# Altium project ICwT_module.PrjPCB
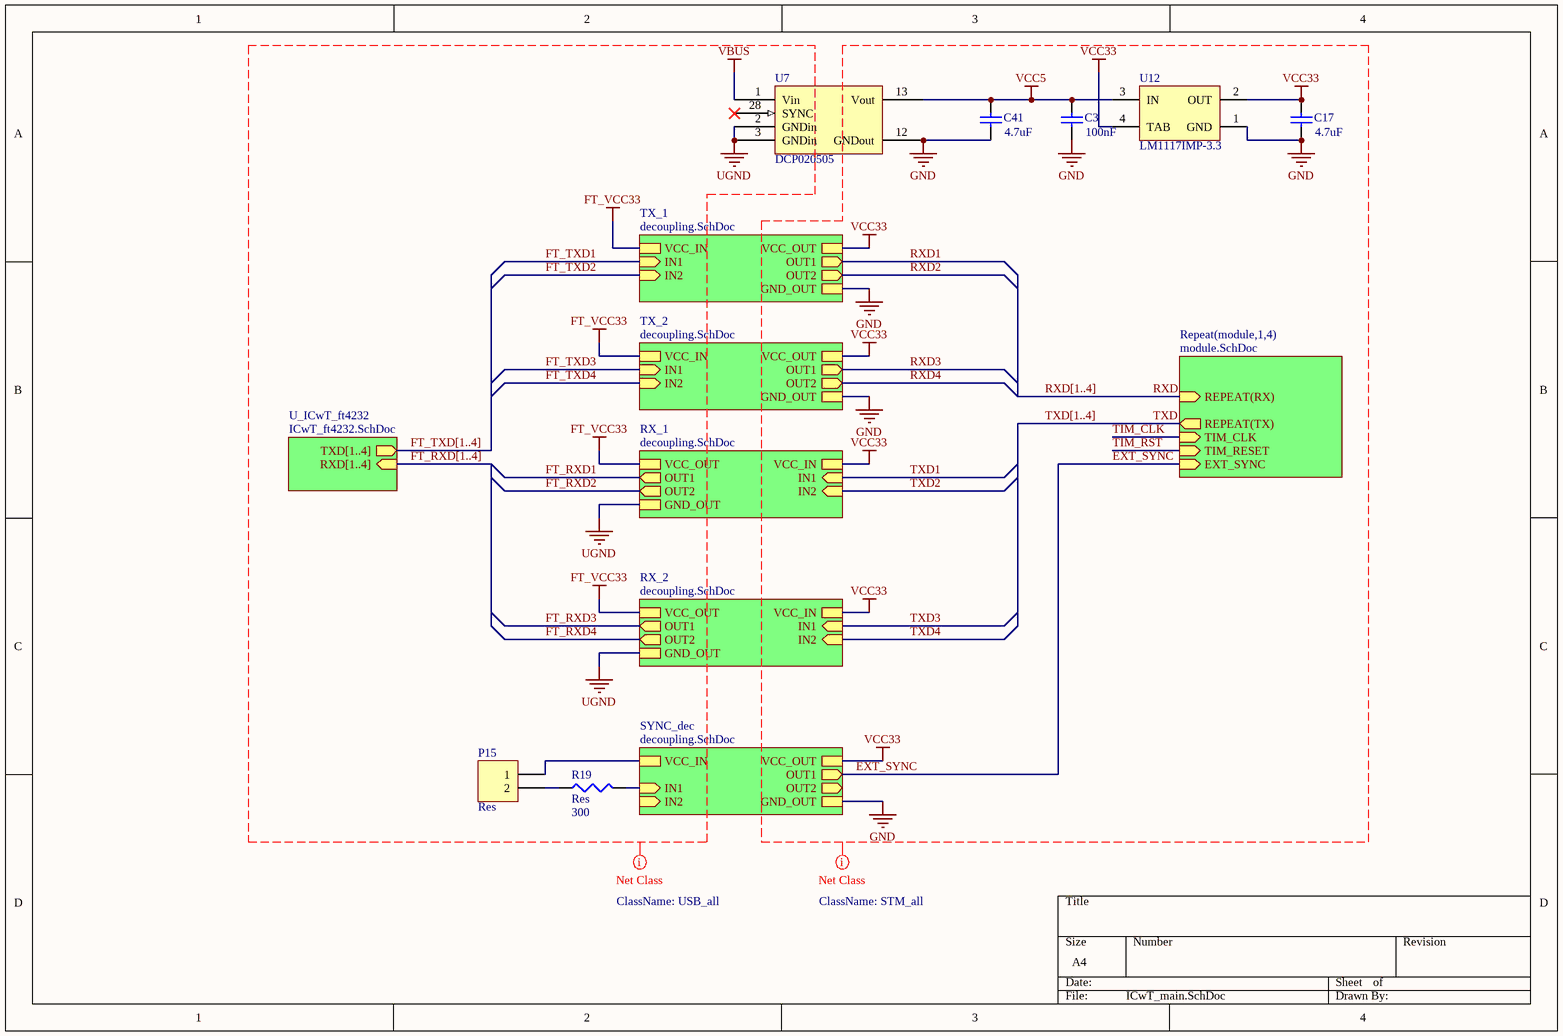
[diagram p0: ICwT_main.SchDoc]
7 sheets, 241 parts. Net scope: hierarchical (ports join the sheet entries above them; power ports are global).
Board files: ICwT.PcbDoc, g738.PcbDoc
Sheets:
  ICwT_main.SchDoc
    TX_2 = decoupling.SchDoc
    SYNC_dec = decoupling.SchDoc
    U_ICwT_ft4232 = ICwT_ft4232.SchDoc
    RX_1 = decoupling.SchDoc
    TX_1 = decoupling.SchDoc
    RX_2 = decoupling.SchDoc
    module1 = module.SchDoc
      STM32 = STM32.SchDoc
      External_iface = RS_iface.SchDoc
      Power selector = Power.SchDoc
    module2 = module.SchDoc
      STM32 = STM32.SchDoc
      External_iface = RS_iface.SchDoc
      Power selector = Power.SchDoc
    module3 = module.SchDoc
      STM32 = STM32.SchDoc
      External_iface = RS_iface.SchDoc
      Power selector = Power.SchDoc
    module4 = module.SchDoc
      STM32 = STM32.SchDoc
      External_iface = RS_iface.SchDoc
      Power selector = Power.SchDoc

## Sheet ICwT_main.SchDoc
size A4

### Parts
(Parts that share a designator on the sheet are numbered #1, #2 ... from top to bottom, then left to right.)
C3#1  value 100nF  [C_0603]  (hidden comment: Cap)
C17#1  value 4.7uF  [C_0603]  (hidden comment: Cap)
C41#1  value 4.7uF  [C_0603]  (hidden comment: Cap)
P15#1  Res  [PAS]
R19#1  Res  value 300  [R_0603]
U7#1  DCP020505  [SOP127P1020X280-28M]
U12#1  LM1117IMP-3.3  [MP04A_L]

### Sub-sheets
Repeat(module,1,4) = module.SchDoc: TIM_CLK (in), TIM_RESET (in), EXT_SYNC (in), REPEAT(RX) (in), REPEAT(TX) (out)
RX_1 = decoupling.SchDoc: VCC_IN, VCC_OUT, GND_OUT, IN1 (in), OUT1 (out), IN2 (in), OUT2 (out)
RX_2 = decoupling.SchDoc: VCC_IN, VCC_OUT, GND_OUT, IN1 (in), OUT1 (out), IN2 (in), OUT2 (out)
SYNC_dec = decoupling.SchDoc: VCC_IN, VCC_OUT, GND_OUT, IN1 (in), OUT1 (out), IN2 (in), OUT2 (out)
TX_1 = decoupling.SchDoc: VCC_IN, VCC_OUT, GND_OUT, IN1 (in), OUT1 (out), IN2 (in), OUT2 (out)
TX_2 = decoupling.SchDoc: VCC_IN, VCC_OUT, GND_OUT, IN1 (in), OUT1 (out), IN2 (in), OUT2 (out)
U_ICwT_ft4232 = ICwT_ft4232.SchDoc: TXD[1..4] (out), RXD[1..4] (in)

### Nets
FT_VCC33: sheet TX_2/VCC_IN, sheet RX_1/VCC_OUT, sheet TX_1/VCC_IN, sheet RX_2/VCC_OUT
GND: C3#1.1 C17#1.1 C41#1.1 U7#1.12(GNDout) U12#1.1(GND) ; sheet TX_2/GND_OUT, sheet SYNC_dec/GND_OUT, sheet TX_1/GND_OUT
UGND: U7#1.2(GNDin) U7#1.3(GNDin) ; sheet RX_1/GND_OUT, sheet RX_2/GND_OUT
VBUS: U7#1.1(Vin)
VCC5: C3#1.2 C41#1.2 U7#1.13(Vout) U12#1.3(IN)
VCC33: C17#1.2 U12#1.2(OUT) U12#1.4(TAB) ; sheet TX_2/VCC_OUT, sheet SYNC_dec/VCC_OUT, sheet RX_1/VCC_IN, sheet TX_1/VCC_OUT, sheet RX_2/VCC_IN  [project net 3.3VDC]
EXT_SYNC: sheet SYNC_dec/OUT1, sheet Repeat(module,1,4)/EXT_SYNC
RXD: sheet Repeat(module,1,4)/REPEAT(RX)
TXD: sheet Repeat(module,1,4)/REPEAT(TX)
NetP15#1_1: P15#1.1 ; sheet SYNC_dec/VCC_IN
NetP15#1_2: P15#1.2 R19#1.1
NetR19#1_2: R19#1.2 ; sheet SYNC_dec/IN1

Not connected (* = marked no-connect by the designer): U7#1 14(NC) 15(NC) 16(NC) 17(NC) 26(NC) 27(NC) 28(SYNC)*

### Buses and harness runs
bus FT_RXD[1..4] = sheet U_ICwT_ft4232/RXD[1..4]
bus FT_TXD[1..4] = sheet U_ICwT_ft4232/TXD[1..4]
bus RXD[1..4]
bus TXD[1..4]

### Layout directives
net class USB_all: FT_RXD1, FT_RXD2, FT_RXD3, FT_RXD4, FT_RXD[1..4], FT_TXD1, FT_TXD2, FT_TXD3, FT_TXD4, FT_TXD[1..4], FT_VCC33, UGND, VBUS
net class STM_all: EXT_SYNC, GND, RXD, RXD1, RXD2, RXD3, RXD4, RXD[1..4], TIM_CLK, TIM_RST, TXD, TXD1, TXD2, TXD3, TXD4, TXD[1..4], VCC5, VCC33

### Library data of the parts
C3#1 C17#1 C41#1 = Cap: Capacitor; Published: 8-Jun-2000; LatestRevisionDate: 17-Jul-2002; LatestRevisionNote: Re-released for DXP Platform.; PackageReference: RAD-0.3; Publisher: Altium Limited; PackageDescription: Radial Cap, Thru-Hole; 2 Leads; 0.3 in Pin Spacing
P15#1 = Header 2: Header, 2-Pin, 3.5mm pitch; LatestRevisionDate: 17-Jul-2002; LatestRevisionNote: Re-released for DXP Platform.; Publisher: Altium Limited
R19#1 = Res3: Resistor; Published: 8-Jun-2000; LatestRevisionDate: 29-May-2009; LatestRevisionNote: IPC-7351 Footprint Added.; PackageReference: J1-0603; Publisher: Altium Limited; PackageDescription: Chip Resistor
U7#1 = DCP020505: Power galvanic isolation
U12#1 = LM1117IMP-3.3: 800mA Low-Dropout Linear Regulator; Manufacturer: National Semiconductor; CompType: LDO IC; PackageTopMarking: XYTT*N05B; PowerWise: N; Published: 4-Dec-2008; DatasheetVersion: Apr-2006; PackageVersion: revB, Apr-2003; PackageReference: MP04A; Publisher: Altium Limited; PackageDescription: Molded SOT-223, 6.50 x 3.56 x 1.6mm Body, 4 Lead, 2.3mm Pitch; PartNumber: LM1117IMP-3.3; RoHS: O; PinCount: 4; DigiKeyPartNumber: LM1117IMP-3.3CT-ND; Code_JEDEC: TO-261-AA; Code_IPC: SOT223-4; ComponentLink1Description: LM1117 Datasheet; ComponentLink1URL: http://www.national.com/ds/LM/LM1117.pdf; ComponentLink2Description: LM1117 Web Page; ComponentLink2URL: http://www.national.com/pf/LM/LM1117.html; ComponentLink3Description: MP04A Package Page; ComponentLink3URL: http://www.national.com/packaging/folders/mp04a.html

## Sheet decoupling.SchDoc
size A4; DocumentNumber: 2; SheetNumber: 2; SheetTotal: 6
Used 5 times, as channels TX_2, SYNC_dec, RX_1, TX_1, RX_2. Parts and nets are listed once, with the designators drawn on the sheet.
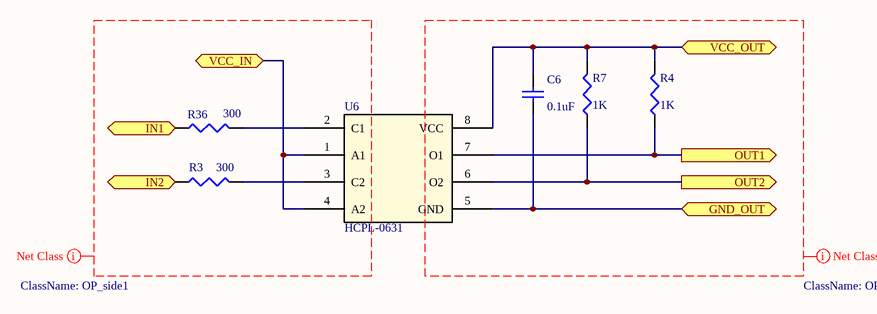
[diagram p1: decoupling.SchDoc]

### Parts
C6  value 0.1uF  [C_0603]  (hidden comment: Cap)
R3  value 300  [R_0603]  (hidden comment: Res)
R4  value 1K  [R_0603]  (hidden comment: Res)
R7  value 1K  [R_0603]  (hidden comment: Res)
R36  value 300  [R_0603]  (hidden comment: Res)
U6  HCPL-0631  [SO8_M]

### Ports
GND_OUT, IN1 (in), IN2 (in), OUT1 (out), OUT2 (out), VCC_IN, VCC_OUT

### Nets
GND_OUT: C6.1 U6.5(GND) ; port GND_OUT
IN1: R36.1 ; port IN1
IN2: R3.1 ; port IN2
OUT1: R4.1 U6.7(O1) ; port OUT1
OUT2: R7.1 U6.6(O2) ; port OUT2
VCC_IN: U6.1(A1) U6.4(A2) ; port VCC_IN
VCC_OUT: C6.2 R4.2 R7.2 U6.8(VCC) ; port VCC_OUT
NetR3_2: R3.2 U6.3(C2)
NetR36_2: R36.2 U6.2(C1)

### Channels
TX_2: designators C6=C54 R3=R44 R4=R36 R7=R40#1 R36=R37 U6=U11; ports GND_OUT=GND IN1=FT_TXD3 IN2=FT_TXD4 OUT1=RX_U OUT2=RX_U VCC_IN=FT_VCC33 VCC_OUT=3.3VDC
SYNC_dec: designators C6=C53 R3=R61 R4=R47 R7=R48 R36=R60 U6=U17; ports GND_OUT=GND IN1=NetR19#1_2 IN2=NetR61_1 OUT1=EXT_SYNC OUT2=NetR48_1 VCC_IN=NetP15#1_1 VCC_OUT=3.3VDC
RX_1: designators C6=C56 R3=R51 R4=R41 R7=R49 R36=R45 U6=U13; ports GND_OUT=UGND IN1=TX_U IN2=TX_U OUT1=FT_RXD1 OUT2=FT_RXD2 VCC_IN=3.3VDC VCC_OUT=FT_VCC33
TX_1: designators C6=C62 R3=R53 R4=R59 R7=R54 R36=R58 U6=U19; ports GND_OUT=GND IN1=FT_TXD1 IN2=FT_TXD2 OUT1=RX_U OUT2=RX_U VCC_IN=FT_VCC33 VCC_OUT=3.3VDC
RX_2: designators C6=C50 R3=R39 R4=R50 R7=R42 R36=R46 U6=U12#2; ports GND_OUT=UGND IN1=TX_U IN2=TX_U OUT1=FT_RXD3 OUT2=FT_RXD4 VCC_IN=3.3VDC VCC_OUT=FT_VCC33

### Layout directives
net class OP_side1: (no net found under the mark)
net class OP_side2: (no net found under the mark)

### Library data of the parts
C6 = Cap Semi: Capacitor; Published: 8-Jun-2000; LatestRevisionDate: 29-May-2009; LatestRevisionNote: IPC-7351 Footprint Added.; PackageReference: C1206; Publisher: Altium Limited; PackageDescription: Chip Capacitor
R3 R4 R7 R36 = Res3: Resistor; Published: 8-Jun-2000; LatestRevisionDate: 29-May-2009; LatestRevisionNote: IPC-7351 Footprint Added.; PackageReference: J1-0603; Publisher: Altium Limited; PackageDescription: Chip Resistor
U6 = HCPL-0631: Optocoupler, dual

## Sheet ICwT_ft4232.SchDoc
size A4
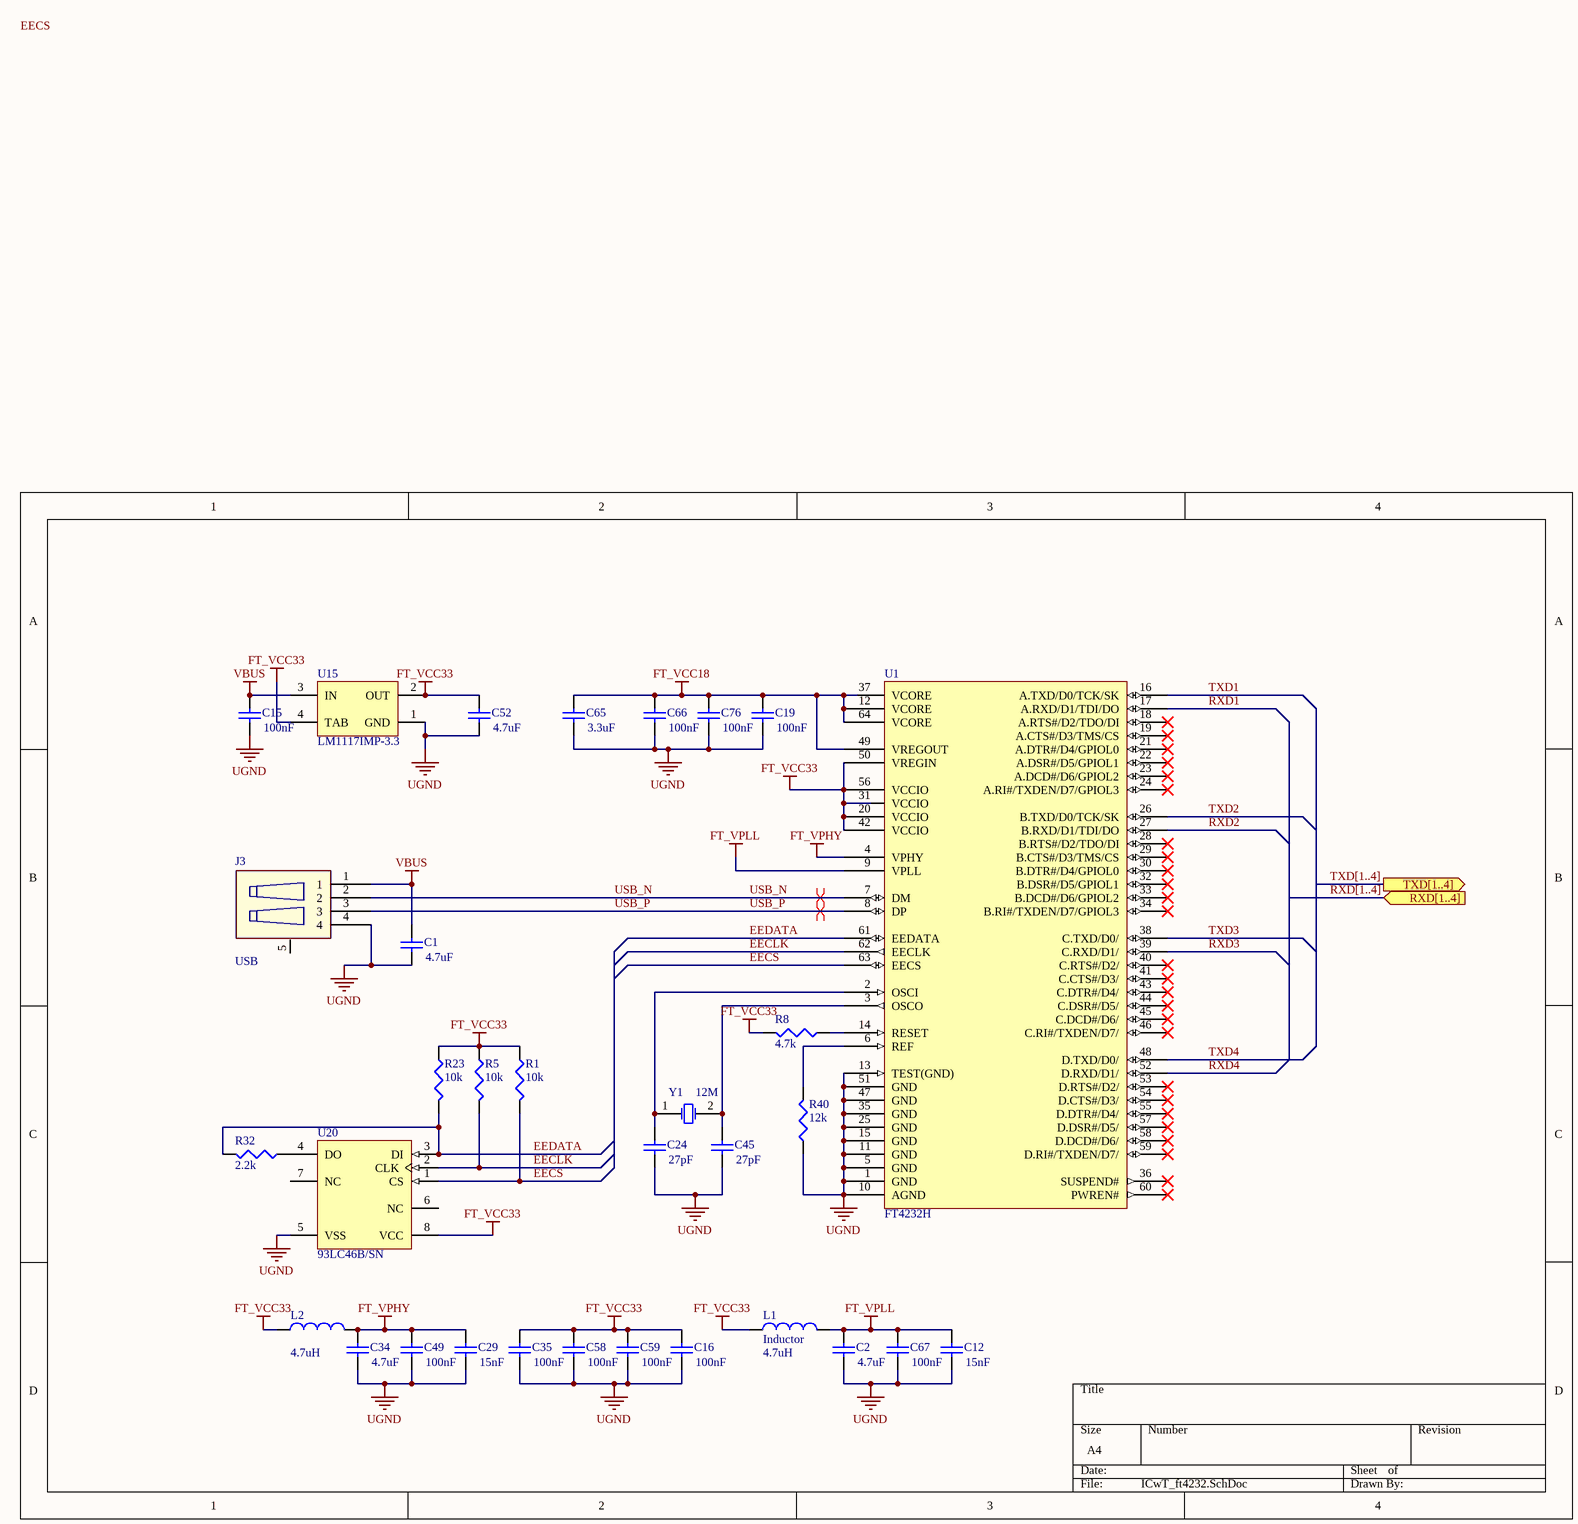
[diagram p2: ICwT_ft4232.SchDoc]

### Parts
(Parts that share a designator on the sheet are numbered #1, #2 ... from top to bottom, then left to right.)
C1#1  value 4.7uF  [C_0603]  (hidden comment: Cap)
C2#1  value 4.7uF  [C_0603]  (hidden comment: Cap)
C12#1  value 15nF  [C_0603]  (hidden comment: Cap)
C15#1  value 100nF  [C_0603]  (hidden comment: Cap)
C16#1  value 100nF  [C_0603]  (hidden comment: Cap)
C19#1  value 100nF  [C_0603]  (hidden comment: Cap)
C24#1  value 27pF  [C_0603]  (hidden comment: Cap)
C29#1  value 15nF  [C_0603]  (hidden comment: Cap)
C34#1  value 4.7uF  [C_0603]  (hidden comment: Cap)
C35#1  value 100nF  [C_0603]  (hidden comment: Cap)
C45#1  value 27pF  [C_0603]  (hidden comment: Cap)
C49#1  value 100nF  [C_0603]  (hidden comment: Cap)
C52#1  value 4.7uF  [C_0603]  (hidden comment: Cap)
C58  value 100nF  [C_0603]  (hidden comment: Cap)
C59  value 100nF  [C_0603]  (hidden comment: Cap)
C65  value 3.3uF  [C_0603]  (hidden comment: Cap)
C66  value 100nF  [C_0603]  (hidden comment: Cap)
C67  value 100nF  [C_0603]  (hidden comment: Cap)
C76  value 100nF  [C_0603]  (hidden comment: Cap)
J3#1  USB  [USBB]
L1  Inductor  value 4.7uH  [L_0805]
L2  value 4.7uH  [L_0805]  (hidden comment: Inductor)
R1#1  value 10k  [R_0603]  (hidden comment: Res)
R5#1  value 10k  [R_0603]  (hidden comment: Res)
R8#1  value 4.7k  [R_0603]  (hidden comment: Res)
R23#1  value 10k  [R_0603]  (hidden comment: Res)
R32#1  value 2.2k  [R_0603]  (hidden comment: Res)
R40#2  value 12k  [R_0603]  (hidden comment: Res)
U1#1  FT4232H  [LQFP64_M]
U15#1  LM1117IMP-3.3  [MP04A_L]
U20  93LC46B/SN  [SOIC-SN8_N]
Y1#1  value 12M  [QUARTZ_0532_MJ]  (hidden comment: SMD XTAL)

### Ports
RXD[1..4] (in), TXD[1..4] (out)

### Nets
FT_VCC18: C19#1.2 C65.2 C66.2 C76.2 U1#1.12(VCORE) U1#1.37(VCORE) U1#1.49(VREGOUT) U1#1.64(VCORE)
FT_VCC33: C16#1.2 C35#1.2 C52#1.2 C58.2 C59.2 L1.1 L2.1 R1#1.1 R5#1.1 R8#1.2 R23#1.1 U1#1.20(VCCIO) U1#1.31(VCCIO) U1#1.42(VCCIO) U1#1.50(VREGIN) U1#1.56(VCCIO) U15#1.2(OUT) U15#1.4(TAB) U20.8(VCC)
FT_VPHY: C29#1.2 C34#1.2 C49#1.2 L2.2 U1#1.4(VPHY)
FT_VPLL: C2#1.2 C12#1.2 C67.2 L1.2 U1#1.9(VPLL)
UGND: C1#1.1 C2#1.1 C12#1.1 C15#1.1 C16#1.1 C19#1.1 C24#1.2 C29#1.1 C34#1.1 C35#1.1 C45#1.2 C49#1.1 C52#1.1 C58.1 C59.1 C65.1 C66.1 C67.1 C76.1 J3#1.4 R40#2.1 U1#1.1(GND) U1#1.5(GND) U1#1.10(AGND) U1#1.11(GND) U1#1.13(TEST(GND)) U1#1.15(GND) U1#1.25(GND) U1#1.35(GND) U1#1.47(GND) U1#1.51(GND) U15#1.1(GND) U20.5(VSS)
VBUS: C1#1.2 C15#1.2 J3#1.1 U15#1.3(IN)
EECLK: R5#1.2 U1#1.62(EECLK) U20.2(CLK)
EECS: R1#1.2 U1#1.63(EECS) U20.1(CS)
EEDATA: R23#1.2 R32#1.2 U1#1.61(EEDATA) U20.3(DI)
RXD1: U1#1.17(A.RXD/D1/TDI/DO)  [project net FT_RXD1]
RXD2: U1#1.27(B.RXD/D1/TDI/DO)  [project net FT_RXD2]
RXD3: U1#1.39(C.RXD/D1/)  [project net FT_RXD3]
RXD4: U1#1.52(D.RXD/D1/)  [project net FT_RXD4]
TXD1: U1#1.16(A.TXD/D0/TCK/SK)  [project net FT_TXD1]
TXD2: U1#1.26(B.TXD/D0/TCK/SK)  [project net FT_TXD2]
TXD3: U1#1.38(C.TXD/D0/)  [project net FT_TXD3]
TXD4: U1#1.48(D.TXD/D0/)  [project net FT_TXD4]
USB_N: J3#1.2 U1#1.7(DM)
USB_P: J3#1.3 U1#1.8(DP)
NetC24#1_1: C24#1.1 U1#1.2(OSCI) Y1#1.1(OSC1)
NetC45#1_1: C45#1.1 U1#1.3(OSCO) Y1#1.2(OSC2)
NetR8#1_1: R8#1.1 U1#1.14(RESET)
NetR32#1_1: R32#1.1 U20.4(DO)
NetR40#2_2: R40#2.2 U1#1.6(REF)

Not connected (* = marked no-connect by the designer): J3#1 5; U1#1 18(A.RTS#/D2/TDO/DI)* 19(A.CTS#/D3/TMS/CS)* 21(A.DTR#/D4/GPIOL0)* 22(A.DSR#/D5/GPIOL1)* 23(A.DCD#/D6/GPIOL2)* 24(A.RI#/TXDEN/D7/GPIOL3)* 28(B.RTS#/D2/TDO/DI)* 29(B.CTS#/D3/TMS/CS)* 30(B.DTR#/D4/GPIOL0)* 32(B.DSR#/D5/GPIOL1)* 33(B.DCD#/D6/GPIOL2)* 34(B.RI#/TXDEN/D7/GPIOL3)* 36(SUSPEND#)* 40(C.RTS#/D2/)* 41(C.CTS#/D3/)* 43(C.DTR#/D4/)* 44(C.DSR#/D5/)* 45(C.DCD#/D6/)* 46(C.RI#/TXDEN/D7/)* 53(D.RTS#/D2/)* 54(D.CTS#/D3/)* 55(D.DTR#/D4/)* 57(D.DSR#/D5/)* 58(D.DCD#/D6/)* 59(D.RI#/TXDEN/D7/)* 60(PWREN#)*; U20 6(NC) 7(NC)

### Buses and harness runs
bus RXD[1..4] = port RXD[1..4]
bus TXD[1..4] = port TXD[1..4]

### Layout directives
differential pair: USB_N, USB_P

### Notes on the sheet
- Labels drawn without touching a wire or pin: EECS

### Library data of the parts
C1#1 C2#1 C12#1 C15#1 C16#1 C19#1 C24#1 C29#1 C34#1 C35#1 C45#1 C49#1 C52#1 C58 C59 C65-C67 C76 = Cap: Capacitor; Published: 8-Jun-2000; LatestRevisionDate: 17-Jul-2002; LatestRevisionNote: Re-released for DXP Platform.; PackageReference: RAD-0.3; Publisher: Altium Limited; PackageDescription: Radial Cap, Thru-Hole; 2 Leads; 0.3 in Pin Spacing
J3#1 = USB: USB-B connector
L1 L2 = Inductor: Code_IEC: 1005; Published: 8-Jun-2000; LatestRevisionDate: 29-May-2009; LatestRevisionNote: IPC-7351 Footprint Added.; PackageReference: 0402-A; Publisher: Altium Limited; PackageDescription: Chip Inductor; Code_JEITA: 0402
R1#1 R5#1 R8#1 R23#1 R32#1 R40#2 = Res3: Resistor; Published: 8-Jun-2000; LatestRevisionDate: 29-May-2009; LatestRevisionNote: IPC-7351 Footprint Added.; PackageReference: J1-0603; Publisher: Altium Limited; PackageDescription: Chip Resistor
U1#1 = FT4232H: USR to RS232 transceiver
U15#1 = LM1117IMP-3.3: as U12#1 on sheet ICwT_main; Published: 4-Dec-2008; DatasheetVersion: Apr-2006; PackageVersion: revB, Apr-2003; PackageReference: MP04A; Publisher: Altium Limited; PackageDescription: Molded SOT-223, 6.50 x 3.56 x 1.6mm Body, 4 Lead, 2.3mm Pitch; PartNumber: LM1117IMP-3.3; RoHS: O; PinCount: 4; DigiKeyPartNumber: LM1117IMP-3.3CT-ND; Code_JEDEC: TO-261-AA; Code_IPC: SOT223-4; ComponentLink1Description: LM1117 Datasheet; ComponentLink1URL: http://www.national.com/ds/LM/LM1117.pdf; ComponentLink2Description: LM1117 Web Page; ComponentLink2URL: http://www.national.com/pf/LM/LM1117.html; ComponentLink3Description: MP04A Package Page; ComponentLink3URL: http://www.national.com/packaging/folders/mp04a.html
U20 = 93LC46B/SN: 1K, 64x16-bit, 2.5V Microwire Serial EEPROM, 8-Pin SOIC 150mil, Commercial Temperature; FirstPublished: 29-Jan-2009; DatasheetVersion: revG, May-2008; PackageVersion: revBB, Aug-2009; PackageReference: SOIC-SN8; Publisher: Altium Limited; PackageDescription: 8-Lead Plastic Small Outline (SN) - Narrow, 3.90mm Body [SOIC]; Supplier 1: Digi-Key; Supplier Part Number 1: 93LC46B/SN-ND; Supplier 2: Farnell; Supplier Part Number 2: 9758224; Supplier 3: Newark; Supplier Part Number 3: 65K1153; Code_JEDEC: MS-012; Code_IPC: SOIC127P600-8; ComponentLink1Description: Datasheet; ComponentLink1URL: http://ww1.microchip.com/downloads/en/DeviceDoc/21749G.pdf; ComponentLink2Description: Packaging Specification; ComponentLink2URL: http://www.microchip.com/stellent/groups/techpub_sg/documents/packagingspec/en012702.pdf; ComponentLink3Description: Microchip.com Home; ComponentLink3URL: http://www.microchip.com/
Y1#1 = XTAL: 0532 12MHz XTAL; pin to pad: 1>2 2>4; Published: 8-Jun-2000; LatestRevisionDate: 17-Jul-2002; LatestRevisionNote: Re-released for DXP Platform.; PackageReference: R38; Publisher: Altium Limited; PackageDescription: Crystal, Thru-Hole; 2 Leads; Body 3.1 x 8.2 mm (Dia.xH)

## Sheet module.SchDoc
size A4
Used 4 times, as channels module1, module2, module3, module4. Parts and nets are listed once, with the designators drawn on the sheet.
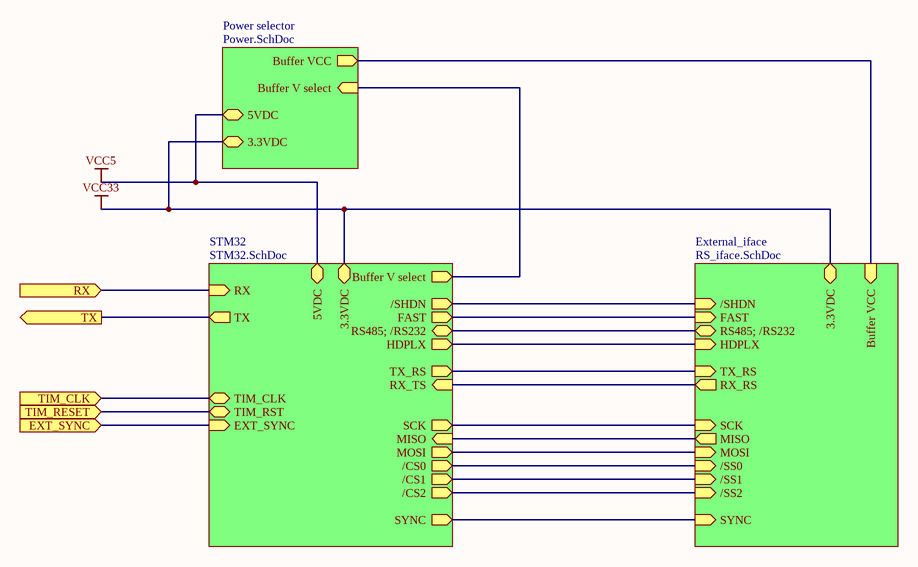
[diagram p3: module.SchDoc]

### Sub-sheets
External_iface = RS_iface.SchDoc: TX_RS (in), RX_RS (out), /SHDN (in), FAST (in), RS485; /RS232, HDPLX (in), SCK (in), MOSI (in), /SS1 (in), /SS2 (in), Buffer VCC (in), SYNC (in), /SS0 (in), MISO (out), 3.3VDC
Power selector = Power.SchDoc: Buffer VCC (out), Buffer V select (in), 5VDC, 3.3VDC
STM32 = STM32.SchDoc: TX_RS (out), RX_TS (in), /SHDN (out), FAST (out), HDPLX (out), Buffer V select (out), 3.3VDC, RS485; /RS232, SCK (out), MISO (in), MOSI (out), /CS2 (out), /CS1 (out), /CS0 (out), SYNC (out), TIM_CLK, EXT_SYNC (in), TIM_RST, 5VDC, TX (out), RX (in)

### Ports
EXT_SYNC (in), RX (in), TIM_CLK (in), TIM_RESET (in), TX (out)

### Nets
VCC5: sheet STM32/5VDC, sheet Power selector/5VDC
VCC33: sheet STM32/3.3VDC, sheet External_iface/3.3VDC, sheet Power selector/3.3VDC
EXT_SYNC: port EXT_SYNC, sheet STM32/EXT_SYNC
RX: port RX, sheet STM32/RX
TIM_CLK: port TIM_CLK, sheet STM32/TIM_CLK
TIM_RESET: port TIM_RESET, sheet STM32/TIM_RST
TX: port TX, sheet STM32/TX
(unnamed): sheet STM32/TX_RS, sheet External_iface/TX_RS
(unnamed): sheet STM32/RX_TS, sheet External_iface/RX_RS
(unnamed): sheet STM32//SHDN, sheet External_iface//SHDN
(unnamed): sheet STM32/FAST, sheet External_iface/FAST
(unnamed): sheet STM32/HDPLX, sheet External_iface/HDPLX
(unnamed): sheet STM32/Buffer V select, sheet Power selector/Buffer V select
(unnamed): sheet STM32/RS485; /RS232, sheet External_iface/RS485; /RS232
(unnamed): sheet STM32/SCK, sheet External_iface/SCK
(unnamed): sheet STM32/MISO, sheet External_iface/MISO
(unnamed): sheet STM32/MOSI, sheet External_iface/MOSI
(unnamed): sheet STM32//CS2, sheet External_iface//SS2
(unnamed): sheet STM32//CS1, sheet External_iface//SS1
(unnamed): sheet STM32//CS0, sheet External_iface//SS0
(unnamed): sheet STM32/SYNC, sheet External_iface/SYNC
(unnamed): sheet External_iface/Buffer VCC, sheet Power selector/Buffer VCC

### Channels
module1: ports EXT_SYNC=EXT_SYNC RX=RX_U TIM_CLK=clk_gen TIM_RESET=rst_gen TX=TX_U
module2: ports EXT_SYNC=EXT_SYNC RX=RX_U TIM_CLK=clk_gen TIM_RESET=rst_gen TX=TX_U
module3: ports EXT_SYNC=EXT_SYNC RX=RX_U TIM_CLK=clk_gen TIM_RESET=rst_gen TX=TX_U
module4: ports EXT_SYNC=EXT_SYNC RX=RX_U TIM_CLK=clk_gen TIM_RESET=rst_gen TX=TX_U

## Sheet STM32.SchDoc
size A3
Used 4 times, as channels module1/STM32, module2/STM32, module3/STM32, module4/STM32. Parts and nets are listed once, with the designators drawn on the sheet.
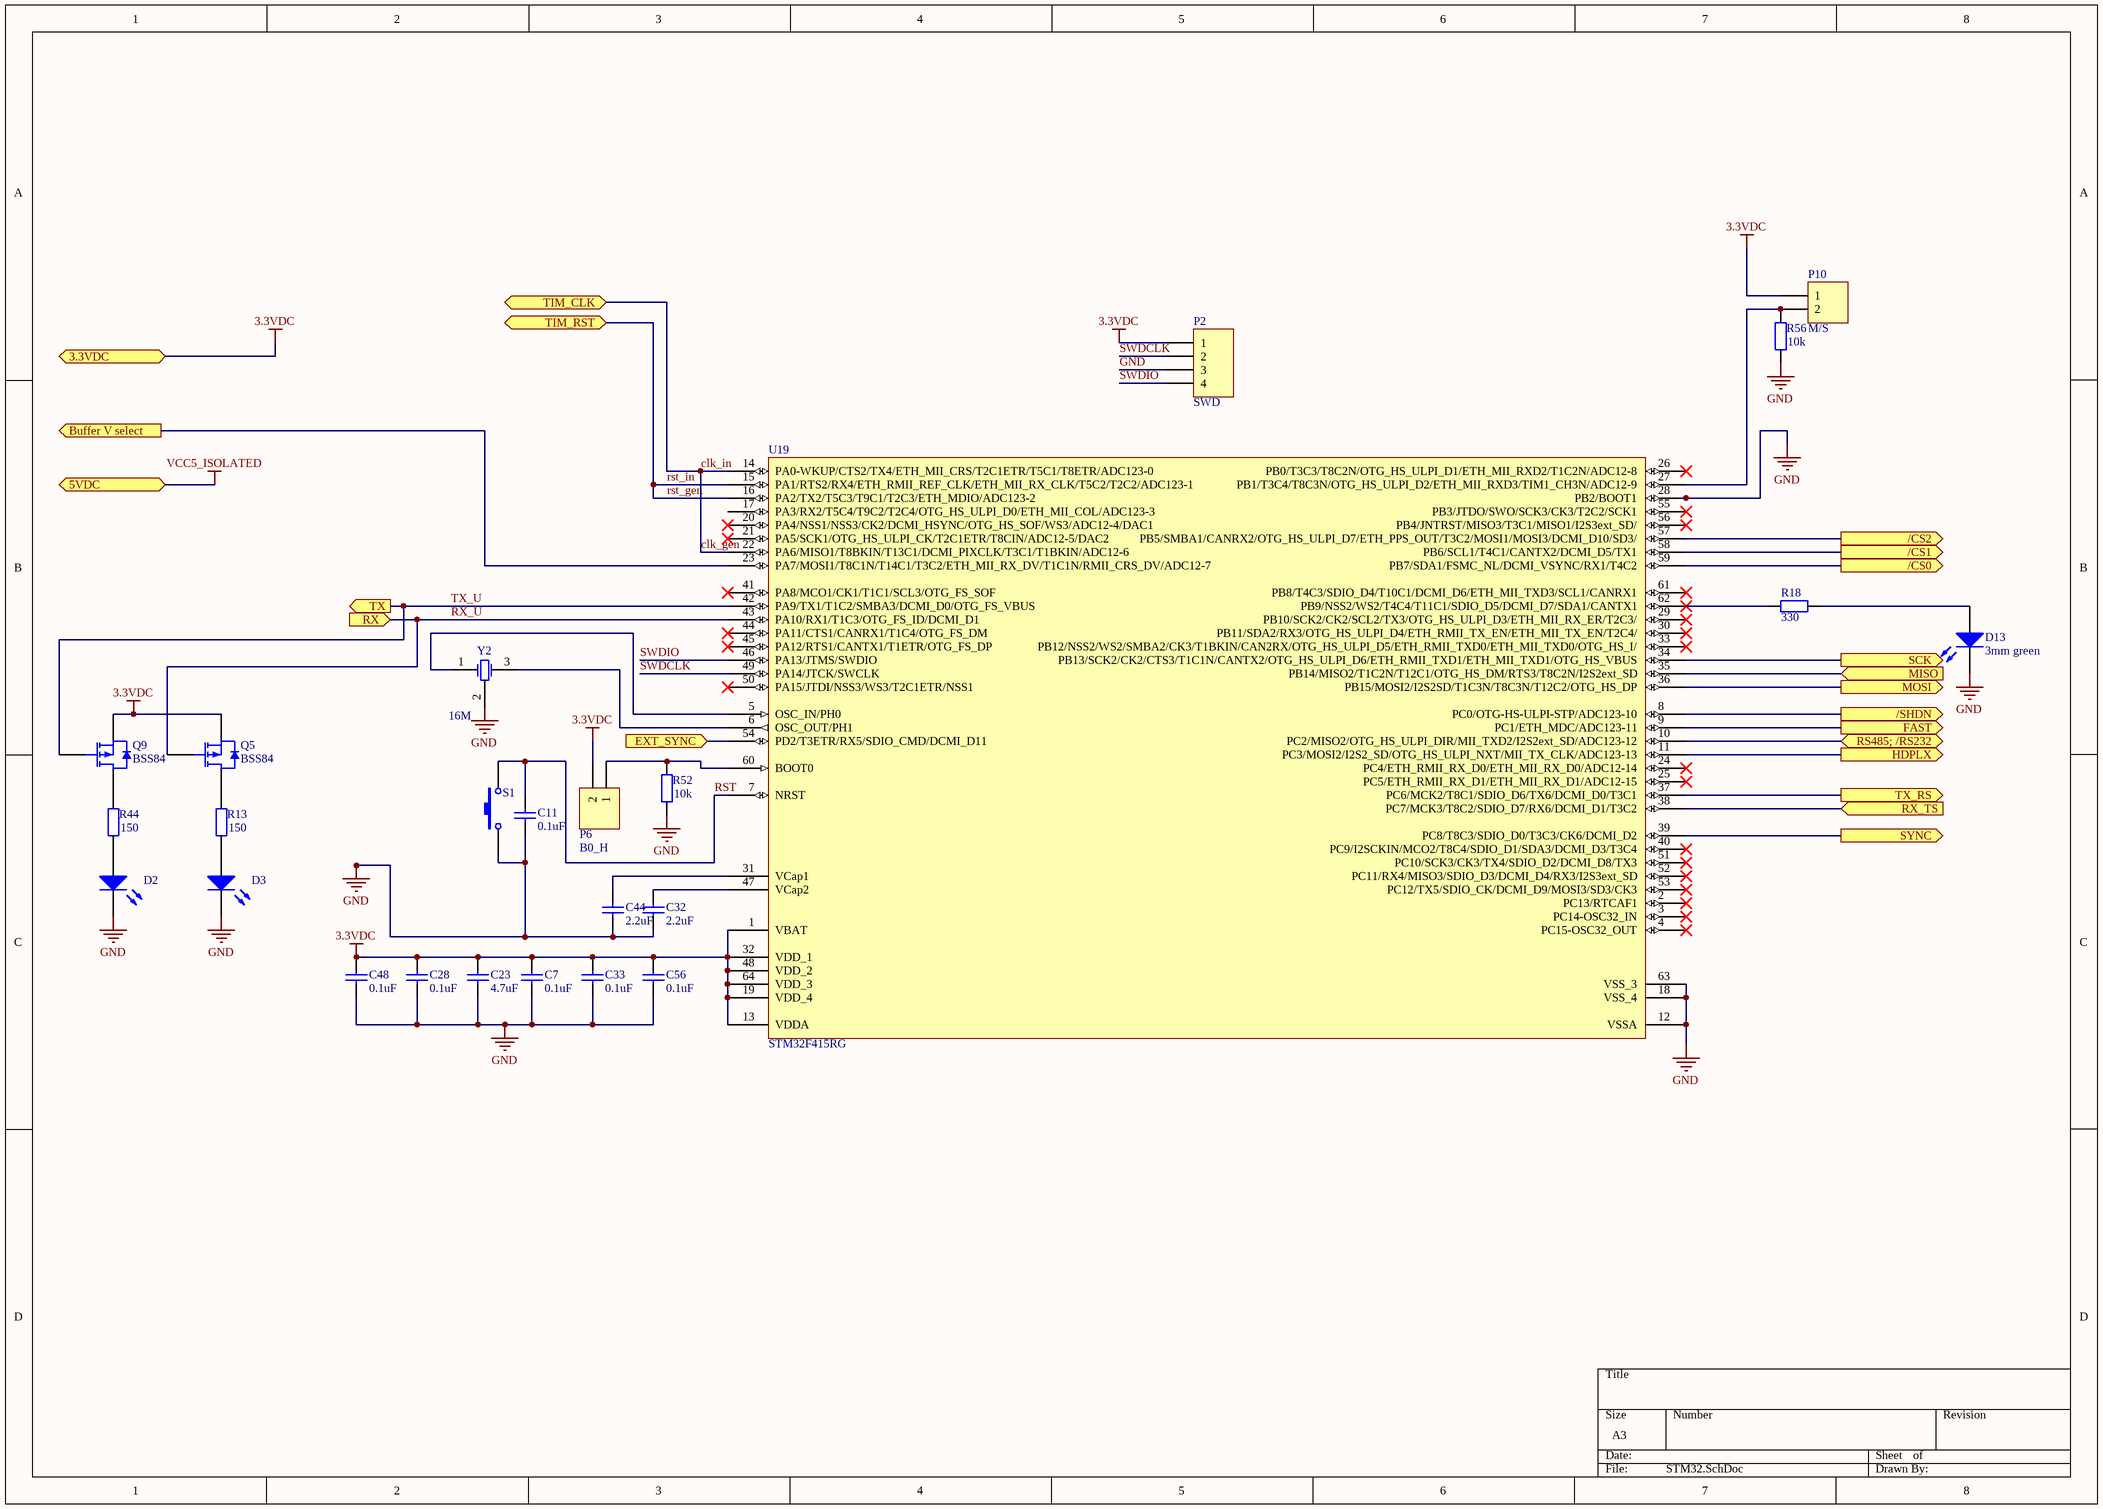
[diagram p4: STM32.SchDoc]

### Parts
C7  value 0.1uF  [C_0603]  (hidden comment: Cap)
C11  value 0.1uF  [C_0603]  (hidden comment: Cap)
C23  value 4.7uF  [C_0603]  (hidden comment: Cap)
C28  value 0.1uF  [C_0603]  (hidden comment: Cap)
C32  value 2.2uF  [C_0603]  (hidden comment: Cap)
C33  value 0.1uF  [C_0603]  (hidden comment: Cap)
C44  value 2.2uF  [C_0603]  (hidden comment: Cap)
C48  value 0.1uF  [C_0603]  (hidden comment: Cap)
C56  value 0.1uF  [C_0603]  (hidden comment: Cap)
D2  3mm led yellow  [Led, 2.54mm pitch]  (value not drawn)
D3  3mm red  [Led, 2.54mm pitch]  (value not drawn)
D13  3mm green  [Led, 2.54mm pitch]
P2  SWD  [HDR1X4]
P6  B0_H  [HDR1X2]
P10  M/S  [HDR1X2]
Q5  BSS84  [SOT23_N]
Q9  BSS84  [SOT23_N]
R13  value 150  [R_0603]  (hidden comment: Res)
R18  value 330  [R_0603]  (hidden comment: Res)
R44  value 150  [R_0603]  (hidden comment: Res)
R52  value 10k  [R_0603]  (hidden comment: Res)
R56  value 10k  [R_0603]  (hidden comment: Res)
S1  RST  [SPST_4DIP]  (value not drawn)
U19  STM32F415RG  [LQFP64]
Y2  value 16M  [XTAL16MHz]  (hidden comment: Murata XTAL)

### Ports
3.3VDC, 5VDC, /CS0 (out), /CS1 (out), /CS2 (out), /SHDN (out), Buffer V select (out), EXT_SYNC (in), FAST (out), HDPLX (out), MISO (in), MOSI (out), RS485; /RS232, RX (in), RX_TS (in), SCK (out), SYNC (out), TIM_CLK, TIM_RST, TX (out), TX_RS (out)

### Nets
3.3VDC: C7.2 C23.2 C28.2 C33.2 C48.2 C56.2 P2.1 P6.2 P10.1 Q5.2(S) Q9.2(S) U19.1(VBAT) U19.13(VDDA) U19.19(VDD_4) U19.32(VDD_1) U19.48(VDD_2) U19.64(VDD_3) ; port 3.3VDC
GND: C7.1 C11.1 C23.1 C28.1 C32.1 C33.1 C44.1 C48.1 C56.1 D2.2(K) D3.2(K) D13.2(K) P2.3 R52.1 R56.1 S1.1 U19.12(VSSA) U19.18(VSS_4) U19.28(PB2/BOOT1) U19.63(VSS_3) Y2.2
VCC5_ISOLATED: port 5VDC
/CS0: U19.59(PB7/SDA1/FSMC_NL/DCMI_VSYNC/RX1/T4C2) ; port /CS0
/CS1: U19.58(PB6/SCL1/T4C1/CANTX2/DCMI_D5/TX1) ; port /CS1
/CS2: U19.57(PB5/SMBA1/CANRX2/OTG_HS_ULPI_D7/ETH_PPS_OUT/T3C2/MOSI1/MOSI3/DCMI_D10/SD3/) ; port /CS2
/SHDN: U19.8(PC0/OTG-HS-ULPI-STP/ADC123-10) ; port /SHDN
Buffer V select: U19.23(PA7/MOSI1/T8C1N/T14C1/T3C2/ETH_MII_RX_DV/T1C1N/RMII_CRS_DV/ADC12-7) ; port Buffer V select
clk_gen: U19.14(PA0-WKUP/CTS2/TX4/ETH_MII_CRS/T2C1ETR/T5C1/T8ETR/ADC123-0) U19.22(PA6/MISO1/T8BKIN/T13C1/DCMI_PIXCLK/T3C1/T1BKIN/ADC12-6) ; port TIM_CLK  [also labelled clk_in]
EXT_SYNC: U19.54(PD2/T3ETR/RX5/SDIO_CMD/DCMI_D11) ; port EXT_SYNC
FAST: U19.9(PC1/ETH_MDC/ADC123-11) ; port FAST
HDPLX: U19.11(PC3/MOSI2/I2S2_SD/OTG_HS_ULPI_NXT/MII_TX_CLK/ADC123-13) ; port HDPLX
MISO: U19.35(PB14/MISO2/T1C2N/T12C1/OTG_HS_DM/RTS3/T8C2N/I2S2ext_SD) ; port MISO
MOSI: U19.36(PB15/MOSI2/I2S2SD/T1C3N/T8C3N/T12C2/OTG_HS_DP) ; port MOSI
RS485; /RS232: U19.10(PC2/MISO2/OTG_HS_ULPI_DIR/MII_TXD2/I2S2ext_SD/ADC123-12) ; port RS485; /RS232
RST: C11.2 S1.2 U19.7(NRST)
rst_gen: U19.15(PA1/RTS2/RX4/ETH_RMII_REF_CLK/ETH_MII_RX_CLK/T5C2/T2C2/ADC123-1) U19.16(PA2/TX2/T5C3/T9C1/T2C3/ETH_MDIO/ADC123-2) ; port TIM_RST  [also labelled rst_in]
RX_TS: U19.38(PC7/MCK3/T8C2/SDIO_D7/RX6/DCMI_D1/T3C2) ; port RX_TS
RX_U: Q5.1(G) U19.43(PA10/RX1/T1C3/OTG_FS_ID/DCMI_D1) ; port RX
SCK: U19.34(PB13/SCK2/CK2/CTS3/T1C1N/CANTX2/OTG_HS_ULPI_D6/ETH_RMII_TXD1/ETH_MII_TXD1/OTG_HS_VBUS) ; port SCK
SWDCLK: P2.2 U19.49(PA14/JTCK/SWCLK)
SWDIO: P2.4 U19.46(PA13/JTMS/SWDIO)
SYNC: U19.39(PC8/T8C3/SDIO_D0/T3C3/CK6/DCMI_D2) ; port SYNC
TX_RS: U19.37(PC6/MCK2/T8C1/SDIO_D6/TX6/DCMI_D0/T3C1) ; port TX_RS
TX_U: Q9.1(G) U19.42(PA9/TX1/T1C2/SMBA3/DCMI_D0/OTG_FS_VBUS) ; port TX
NetC32_2: C32.2 U19.47(VCap2)
NetC44_2: C44.2 U19.31(VCap1)
NetD2_1: D2.1(A) R44.1
NetD3_1: D3.1(A) R13.1
NetD13_1: D13.1(A) R18.2
NetP6_1: P6.1 R52.2 U19.60(BOOT0)
NetP10_2: P10.2 R56.2 U19.27(PB1/T3C4/T8C3N/OTG_HS_ULPI_D2/ETH_MII_RXD3/TIM1_CH3N/ADC12-9)
NetQ5_3: Q5.3(D) R13.2
NetQ9_3: Q9.3(D) R44.2
NetR18_1: R18.1 U19.62(PB9/NSS2/WS2/T4C4/T11C1/SDIO_D5/DCMI_D7/SDA1/CANTX1)
NetU19_5: U19.5(OSC_IN/PH0) Y2.1
NetU19_6: U19.6(OSC_OUT/PH1) Y2.3

Not connected (* = marked no-connect by the designer): U19 2(PC13/RTCAF1)* 3(PC14-OSC32_IN)* 4(PC15-OSC32_OUT)* 17(PA3/RX2/T5C4/T9C2/T2C4/OTG_HS_ULPI_D0/ETH_MII_COL/ADC123-3) 20(PA4/NSS1/NSS3/CK2/DCMI_HSYNC/OTG_HS_SOF/WS3/ADC12-4/DAC1)* 21(PA5/SCK1/OTG_HS_ULPI_CK/T2C1ETR/T8CIN/ADC12-5/DAC2)* 24(PC4/ETH_RMII_RX_D0/ETH_MII_RX_D0/ADC12-14)* 25(PC5/ETH_RMII_RX_D1/ETH_MII_RX_D1/ADC12-15)* 26(PB0/T3C3/T8C2N/OTG_HS_ULPI_D1/ETH_MII_RXD2/T1C2N/ADC12-8)* 29(PB10/SCK2/CK2/SCL2/TX3/OTG_HS_ULPI_D3/ETH_MII_RX_ER/T2C3/)* 30(PB11/SDA2/RX3/OTG_HS_ULPI_D4/ETH_RMII_TX_EN/ETH_MII_TX_EN/T2C4/)* 33(PB12/NSS2/WS2/SMBA2/CK3/T1BKIN/CAN2RX/OTG_HS_ULPI_D5/ETH_RMII_TXD0/ETH_MII_TXD0/OTG_HS_I/)* 40(PC9/I2SCKIN/MCO2/T8C4/SDIO_D1/SDA3/DCMI_D3/T3C4)* 41(PA8/MCO1/CK1/T1C1/SCL3/OTG_FS_SOF)* 44(PA11/CTS1/CANRX1/T1C4/OTG_FS_DM)* 45(PA12/RTS1/CANTX1/T1ETR/OTG_FS_DP)* 50(PA15/JTDI/NSS3/WS3/T2C1ETR/NSS1)* 51(PC10/SCK3/CK3/TX4/SDIO_D2/DCMI_D8/TX3)* 52(PC11/RX4/MISO3/SDIO_D3/DCMI_D4/RX3/I2S3ext_SD)* 53(PC12/TX5/SDIO_CK/DCMI_D9/MOSI3/SD3/CK3)* 55(PB3/JTDO/SWO/SCK3/CK3/T2C2/SCK1)* 56(PB4/JNTRST/MISO3/T3C1/MISO1/I2S3ext_SD/)* 61(PB8/T4C3/SDIO_D4/T10C1/DCMI_D6/ETH_MII_TXD3/SCL1/CANRX1)*

### Channels
module1/STM32: designators C7=C17#2 C11=C25 C23=C38 C28=C46 C32=C33 C33=C21 C44=C13 C48=C30 C56=C41#2 D2=D4 D3=D5 D13=D6 P2=P8 P6=P12 P10=P4 Q5=Q4 Q9=Q8 R13=R28 R18=R20 R44=R32#2 R52=R24 R56=R19#2 S1=S1 U19=U7#2 Y2=Y1#2; ports 3.3VDC=3.3VDC 5VDC=VCC5 /CS0=CS0 /CS1=CS1 /CS2=CS2 /SHDN=/SHDN Buffer V select=NetQ12_2 EXT_SYNC=EXT_SYNC FAST=FAST HDPLX=HDPLX MISO=MISO MOSI=MOSI RS485; /RS232=RS485; /RS232 RX=RX_U RX_TS=RX(TO STM) SCK=SCK SYNC=NetU7#2_39 TIM_CLK=clk_gen TIM_RST=rst_gen TX=TX_U TX_RS=TX(FROM STM)
module2/STM32: designators C7=C18 C11=C26 C23=C39 C28=C47 C32=C34#2 C33=C22 C44=C14 C48=C31 C56=C42 D2=D10 D3=D7 D13=D8 P2=P9 P6=P13 P10=P5 Q5=Q6 Q9=Q10 R13=R29 R18=R21 R44=R33 R52=R25 R56=R16 S1=S3 U19=U8 Y2=Y2; ports 3.3VDC=3.3VDC 5VDC=VCC5 /CS0=CS0 /CS1=CS1 /CS2=CS2 /SHDN=/SHDN Buffer V select=NetQ2_2 EXT_SYNC=EXT_SYNC FAST=FAST HDPLX=HDPLX MISO=MISO MOSI=MOSI RS485; /RS232=RS485; /RS232 RX=RX_U RX_TS=RX(TO STM) SCK=SCK SYNC=NetU2_9 TIM_CLK=clk_gen TIM_RST=rst_gen TX=TX_U TX_RS=TX(FROM STM)
module3/STM32: designators C7=C19#2 C11=C27 C23=C37 C28=C45#2 C32=C35#2 C33=C23 C44=C15#2 C48=C29#2 C56=C43 D2=D11 D3=D9 D13=D12 P2=P10 P6=P14 P10=P6 Q5=Q5 Q9=Q9 R13=R30 R18=R22 R44=R34 R52=R26 R56=R17 S1=S2 U19=U9 Y2=Y3; ports 3.3VDC=3.3VDC 5VDC=VCC5 /CS0=CS0 /CS1=CS1 /CS2=CS2 /SHDN=/SHDN Buffer V select=NetQ1_2 EXT_SYNC=EXT_SYNC FAST=FAST HDPLX=HDPLX MISO=MISO MOSI=MOSI RS485; /RS232=RS485; /RS232 RX=RX_U RX_TS=RX(TO STM) SCK=SCK SYNC=NetU3_9 TIM_CLK=clk_gen TIM_RST=rst_gen TX=TX_U TX_RS=TX(FROM STM)
module4/STM32: designators C7=C20 C11=C28 C23=C40 C28=C48 C32=C36 C33=C24#2 C44=C16#2 C48=C32 C56=C44 D2=D15 D3=D13 D13=D14 P2=P11 P6=P15#2 P10=P7 Q5=Q7 Q9=Q11 R13=R31 R18=R23#2 R44=R35 R52=R27 R56=R18 S1=S4 U19=U10 Y2=Y4; ports 3.3VDC=3.3VDC 5VDC=VCC5 /CS0=CS0 /CS1=CS1 /CS2=CS2 /SHDN=/SHDN Buffer V select=NetQ3_2 EXT_SYNC=EXT_SYNC FAST=FAST HDPLX=HDPLX MISO=MISO MOSI=MOSI RS485; /RS232=RS485; /RS232 RX=RX_U RX_TS=RX(TO STM) SCK=SCK SYNC=NetU1#2_9 TIM_CLK=clk_gen TIM_RST=rst_gen TX=TX_U TX_RS=TX(FROM STM)

### Library data of the parts
C7 C11 C23 C28 C32 C33 C44 C48 C56 = C0603: Capacitor; Note: Footprint corresponds to dimensions for bulk cassette packaging. This case size has tightened tolerances.; Published: 17-Jul-2002; LatestRevisionDate: 19-Mar-2004; LatestRevisionNote: Silkscreen size reduced.; PackageReference: 0603; Publisher: Altium Limited; DatasheetDocument: Mar-2001; PackageDocument: Mar-2001; Code_JEITA: 0603; Code_IPC: 1608 [0603]; ComponentLink1Description: Manufacturer Link; ComponentLink1URL: http://www.kemet.com/; ComponentLink2Description: Datasheet; ComponentLink2URL: http://www.kemet.com/kemet/web/homepage/kechome.nsf/vapubfilesname/F3102TA.pdf/$file/F3102TA.pdf
D2 D3 D13 = LED0: Typical INFRARED GaAs LED; Published: 8-Jun-2000; LatestRevisionDate: 08-Jul-2005; LatestRevisionNote: Mech Layer 1 removed.; PackageReference: LED-0; Publisher: Altium Limited; PackageDescription: LED; 2 Leads
P2 = Header 4H: Header, 4-Pin, 2.54mm pitch; LatestRevisionDate: 17-Jul-2002; LatestRevisionNote: Re-released for DXP Platform.; Publisher: Altium Limited
P6 P10 = Header 2H: Header, 2-Pin, 2.54mm pitch; LatestRevisionDate: 17-Jul-2002; LatestRevisionNote: Re-released for DXP Platform.; Publisher: Altium Limited
Q5 Q9 = BSS84: P-channel Enhancement Mode Vertical D-MOSFET; Published: 17-Sep-2003; LatestRevisionDate: 12-Dec-2006; LatestRevisionNote: IPC-7351 Footprint Added.; DatasheetVersion: 18-Jun-1997; PackageVersion: May-1999; PackageReference: SOT23; Publisher: Altium Limited; PackageDescription: 3-Pin SOT-23 Package 0.95 mm Pitch, 2.3 mm Lead Span; ComponentLink1Description: Manufacturer Link; ComponentLink1URL: http://www.semiconductors.philips.com/; ComponentLink2Description: Datasheet; ComponentLink2URL: http://www.semiconductors.philips.com/acrobat/datasheets/BSS84_3.pdf
R13 R18 R44 R52 R56 = Res2: Resistor; Published: 8-Jun-2000; LatestRevisionDate: 17-Jul-2002; LatestRevisionNote: Re-released for DXP Platform.; PackageReference: AXIAL-0.4; Publisher: Altium Limited; PackageDescription: Axial Device, Thru-Hole; 2 Leads; 0.4 in Pin Spacing
S1 = SW-PB: Reset button; Published: 24-Mar-1999; LatestRevisionDate: 17-Jul-2002; LatestRevisionNote: Re-released for DXP Platform.; PackageReference: SPST-2; Publisher: Altium Limited; PackageDescription: Switch; 2 Leads
U19 = STM32F415RG: ST ARM MC; Published: 30-May-2008; DatasheetVersion: rev6, Mar-2008; PackageVersion: Mar-2008; PackageReference: LQFP64; Publisher: Altium Limited; PackageDescription: 64-Pin Low-Profile Quad Flat Pack, 10 x 10 mm Body, 0.5 mm Pitch (LQFP64); ComponentLink1Description: Manufacturer Link; ComponentLink1URL: www.st.com/stm32; ComponentLink2Description: Datasheet; ComponentLink2URL: http://www.st.com/stonline/products/literature/ds/13586.pdf
Y2 = Murata_XTAL: Murata 16 MHz XTAL

## Sheet RS_iface.SchDoc
size A4
Used 4 times, as channels module1/External_iface, module2/External_iface, module3/External_iface, module4/External_iface. Parts and nets are listed once, with the designators drawn on the sheet.
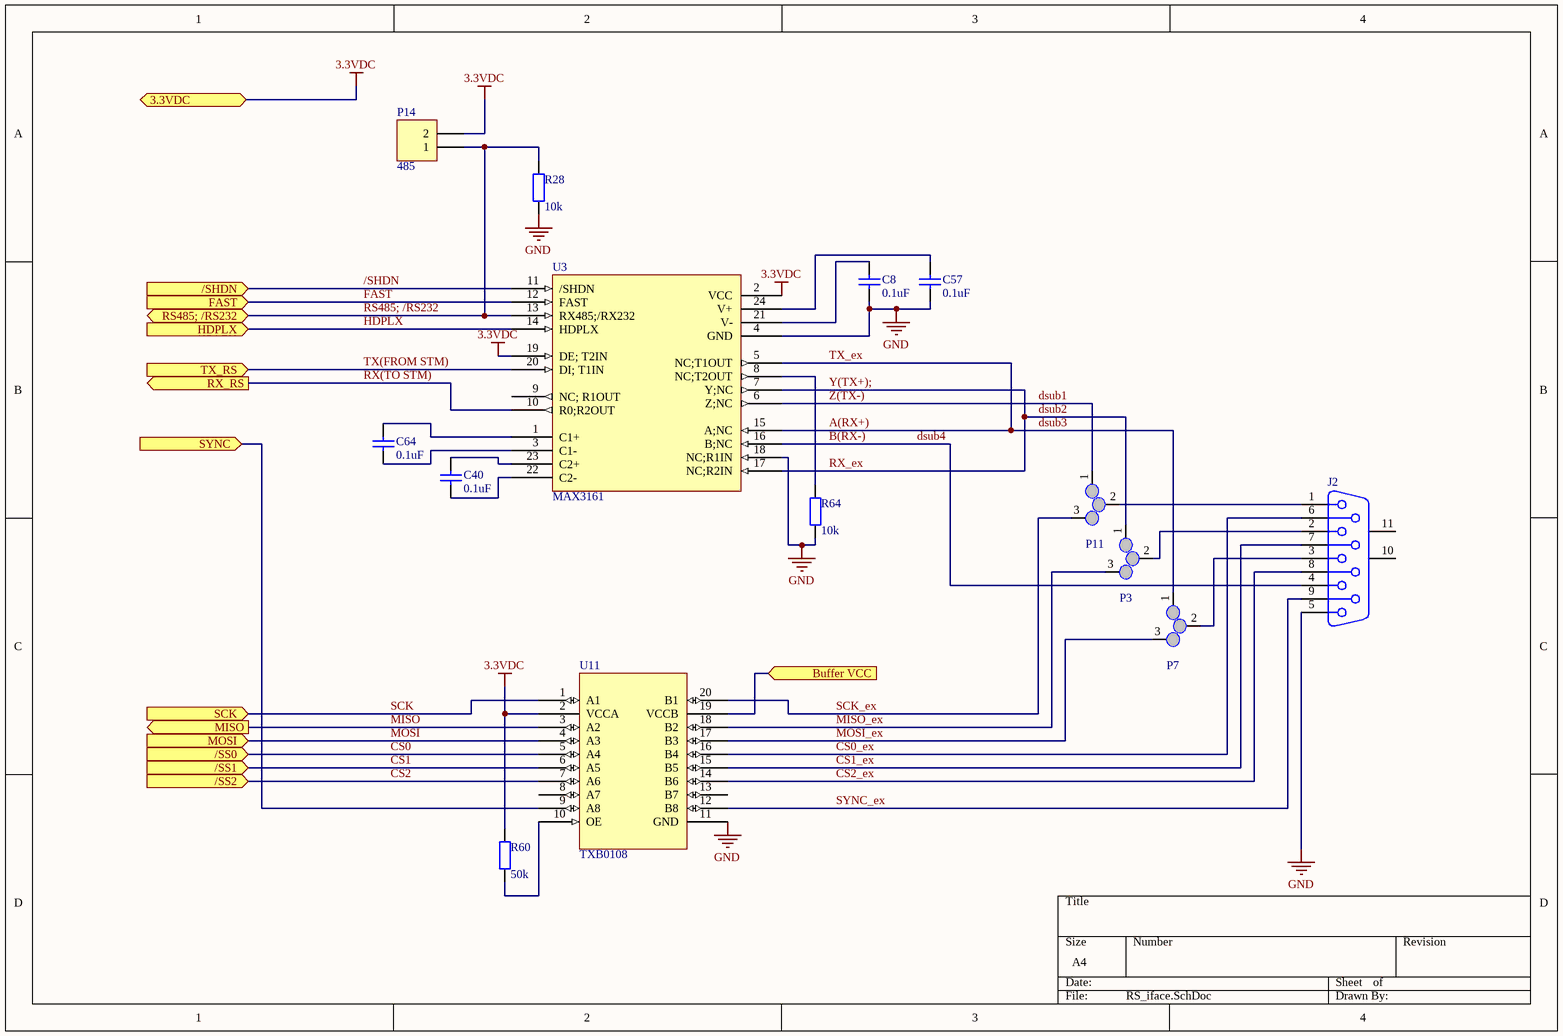
[diagram p5: RS_iface.SchDoc]

### Parts
C8  value 0.1uF  [C_0603]  (hidden comment: Cap)
C40  value 0.1uF  [C_0603]  (hidden comment: Cap)
C57  value 0.1uF  [C_0603]  (hidden comment: Cap)
C64  value 0.1uF  [C_0603]  (hidden comment: Cap)
J2  DSUB Male  [DSUB1.385-2H9M]  (value not drawn)
P3  SWI_CONN  [SW_SPDT]  (value not drawn)  (net tie, no BOM)
P7  SWI_CONN  [SW_SPDT]  (value not drawn)  (net tie, no BOM)
P11  SWI_CONN  [SW_SPDT]  (value not drawn)  (net tie, no BOM)
P14  485  [HDR1X2]
R28  value 10k  [R_0603]  (hidden comment: Res)
R60  value 50k  [R_0603]  (hidden comment: Res)
R64  value 10k  [R_0603]  (hidden comment: Res)
U3  MAX3161  [DB024]
U11  TXB0108  [TSOP65P640X120-20N]

### Ports
3.3VDC, /SHDN (in), /SS0 (in), /SS1 (in), /SS2 (in), Buffer VCC (in), FAST (in), HDPLX (in), MISO (out), MOSI (in), RS485; /RS232, RX_RS (out), SCK (in), SYNC (in), TX_RS (in)

### Nets
3.3VDC: P14.2 R60.2 U3.2(VCC) U3.19(DE;_T2IN) U11.2(VCCA) ; port 3.3VDC
GND: C8.2 C57.2 J2.5 R28.1 R64.1 U3.4(GND) U3.18(NC;R1IN) U11.11(GND)
/SHDN: U3.11(/SHDN) ; port /SHDN
A(RX+): P7.1 U3.5(NC;T1OUT) U3.15(A;NC)  [also labelled dsub3, TX_ex]
B(RX-): J2.4 U3.16(B;NC)  [also labelled dsub4]
Buffer VCC: U11.19(VCCB) ; port Buffer VCC
CS0: U11.5(A4) ; port /SS0
CS0_ex: J2.6 U11.16(B4)
CS1: U11.6(A5) ; port /SS1
CS1_ex: J2.7 U11.15(B5)
CS2: U11.7(A6) ; port /SS2
CS2_ex: J2.8 U11.14(B6)
dsub1: P11.1 U3.6(Z;NC)  [also labelled Z(TX-)]
dsub2: P3.1 U3.7(Y;NC) U3.17(NC;R2IN)  [also labelled RX_ex, Y(TX+);]
FAST: U3.12(FAST) ; port FAST
HDPLX: U3.14(HDPLX) ; port HDPLX
MISO: U11.3(A2) ; port MISO
MISO_ex: P3.3 U11.18(B2)
MOSI: U11.4(A3) ; port MOSI
MOSI_ex: P7.3 U11.17(B3)
RS485; /RS232: P14.1 R28.2 U3.13(RX485;/RX232) ; port RS485; /RS232
RX(TO STM): U3.10(R0;R2OUT) ; port RX_RS
SCK: U11.1(A1) ; port SCK
SCK_ex: P11.3 U11.20(B1)
SYNC: U11.9(A8) ; port SYNC
SYNC_ex: J2.9 U11.12(B8)
TX(FROM STM): U3.20(DI;_T1IN) ; port TX_RS
NetC8_1: C8.1 U3.21(V-)
NetC40_1: C40.1 U3.23(C2+)
NetC40_2: C40.2 U3.22(C2-)
NetC57_1: C57.1 U3.24(V+)
NetC64_1: C64.1 U3.1(C1+)
NetC64_2: C64.2 U3.3(C1-)
NetJ2_1: J2.1 P11.2
NetJ2_2: J2.2 P3.2
NetJ2_3: J2.3 P7.2
NetR60_1: R60.1 U11.10(OE)
NetR64_2: R64.2 U3.8(NC;T2OUT)

Not connected (* = marked no-connect by the designer): J2 10(MH1) 11(MH2); U3 9(NC;_R1OUT); U11 8(A7) 13(B7)

### Channels
module1/External_iface: designators C8=C52#2 C40=C51 C57=C49#2 C64=C64 J2=J5 P3=P27 P7=P28 P11=P29 P14=P16 R28=R38 R60=R43 R64=R52 U3=U15#2 U11=U16; ports 3.3VDC=3.3VDC /SHDN=/SHDN /SS0=CS0 /SS1=CS1 /SS2=CS2 Buffer VCC=NetD16_3 FAST=FAST HDPLX=HDPLX MISO=MISO MOSI=MOSI RS485; /RS232=RS485; /RS232 RX_RS=RX(TO STM) SCK=SCK SYNC=NetU7#2_39 TX_RS=TX(FROM STM)
module2/External_iface: designators C8=C10 C40=C9 C57=C5 C64=C2#2 J2=J2 P3=P25 P7=P20 P11=P21 P14=P2 R28=R8#2 R60=R5#2 R64=R2 U3=U5 U11=U2; ports 3.3VDC=3.3VDC /SHDN=/SHDN /SS0=CS0 /SS1=CS1 /SS2=CS2 Buffer VCC=NetD2_3 FAST=FAST HDPLX=HDPLX MISO=MISO MOSI=MOSI RS485; /RS232=RS485; /RS232 RX_RS=RX(TO STM) SCK=SCK SYNC=NetU2_9 TX_RS=TX(FROM STM)
module3/External_iface: designators C8=C12#2 C40=C11 C57=C6 C64=C3#2 J2=J3#2 P3=P26 P7=P22 P11=P23 P14=P3 R28=R9 R60=R6 R64=R3 U3=U6 U11=U3; ports 3.3VDC=3.3VDC /SHDN=/SHDN /SS0=CS0 /SS1=CS1 /SS2=CS2 Buffer VCC=NetD1_3 FAST=FAST HDPLX=HDPLX MISO=MISO MOSI=MOSI RS485; /RS232=RS485; /RS232 RX_RS=RX(TO STM) SCK=SCK SYNC=NetU3_9 TX_RS=TX(FROM STM)
module4/External_iface: designators C8=C8 C40=C7 C57=C4 C64=C1#2 J2=J1 P3=P24 P7=P18 P11=P19 P14=P1 R28=R7 R60=R4 R64=R1#2 U3=U4 U11=U1#2; ports 3.3VDC=3.3VDC /SHDN=/SHDN /SS0=CS0 /SS1=CS1 /SS2=CS2 Buffer VCC=NetD3_3 FAST=FAST HDPLX=HDPLX MISO=MISO MOSI=MOSI RS485; /RS232=RS485; /RS232 RX_RS=RX(TO STM) SCK=SCK SYNC=NetU1#2_9 TX_RS=TX(FROM STM)

### Library data of the parts
C8 C40 C57 C64 = C0603: as C7 on sheet STM32; Published: 17-Jul-2002; LatestRevisionDate: 19-Mar-2004; LatestRevisionNote: Silkscreen size reduced.; PackageReference: 0603; Publisher: Altium Limited; DatasheetDocument: Mar-2001; PackageDocument: Mar-2001; Code_JEITA: 0603; Code_IPC: 1608 [0603]; ComponentLink1Description: Manufacturer Link; ComponentLink1URL: http://www.kemet.com/; ComponentLink2Description: Datasheet; ComponentLink2URL: http://www.kemet.com/kemet/web/homepage/kechome.nsf/vapubfilesname/F3102TA.pdf/$file/F3102TA.pdf
J2 = D Connector 9: DSUB9 Male connector; PackageDocument: O; Positions: 9; Gender: Receptacle; Published: 15-Jun-2001; LatestRevisionDate: 17-Jul-2002; LatestRevisionNote: Re-released for DXP Platform.; DatasheetDocument: 1-Sep-1999; PackageReference: 788750; Publisher: Altium Limited; Orientation: Right Angle
P3 P7 P11 = SWI_CONN: Soldering switch
P14 = Header 2H: Header, 2-Pin, 2.54mm pitch; LatestRevisionDate: 17-Jul-2002; LatestRevisionNote: Re-released for DXP Platform.; Publisher: Altium Limited
R28 R60 R64 = Res2: Resistor; Published: 8-Jun-2000; LatestRevisionDate: 17-Jul-2002; LatestRevisionNote: Re-released for DXP Platform.; PackageReference: AXIAL-0.4; Publisher: Altium Limited; PackageDescription: Axial Device, Thru-Hole; 2 Leads; 0.4 in Pin Spacing
U3 = MAX3161: Multitrancivier
U11 = TXB0108: SPI buffer

## Sheet Power.SchDoc
size A4
Used 4 times, as channels module1/Power selector, module2/Power selector, module3/Power selector, module4/Power selector. Parts and nets are listed once, with the designators drawn on the sheet.
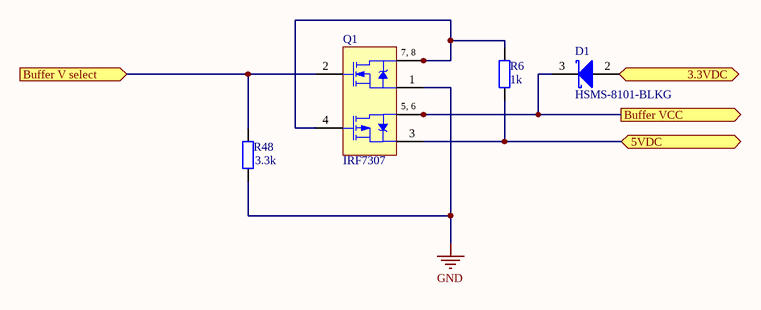
[diagram p6: Power.SchDoc]

### Parts
D1  HSMS-8101-BLKG  [SOT-23_N]
Q1  IRF7307  [SO-8_N]
R6  value 1k  [R_0603]  (hidden comment: Res)
R48  value 3.3k  [R_0603]  (hidden comment: Res)

### Ports
3.3VDC, 5VDC, Buffer V select (in), Buffer VCC (out)

### Nets
GND: Q1.1(S1) R48.1
3.3VDC: D1.2(A) ; port 3.3VDC
5VDC: Q1.3(S2) R6.2 ; port 5VDC
Buffer V select: Q1.2(G1) R48.2 ; port Buffer V select
Buffer VCC: D1.3(K) Q1.5(D2) Q1.6(D2) ; port Buffer VCC
NetQ1_4: Q1.4(G2) Q1.7(D1) Q1.8(D1) R6.1

### Channels
module1/Power selector: designators D1=D16 Q1=Q12 R6=R55 R48=R56; ports 3.3VDC=3.3VDC 5VDC=VCC5 Buffer V select=NetQ12_2 Buffer VCC=NetD16_3
module2/Power selector: designators D1=D2 Q1=Q2 R6=R12 R48=R13; ports 3.3VDC=3.3VDC 5VDC=VCC5 Buffer V select=NetQ2_2 Buffer VCC=NetD2_3
module3/Power selector: designators D1=D1 Q1=Q1 R6=R10 R48=R11; ports 3.3VDC=3.3VDC 5VDC=VCC5 Buffer V select=NetQ1_2 Buffer VCC=NetD1_3
module4/Power selector: designators D1=D3 Q1=Q3 R6=R14 R48=R15; ports 3.3VDC=3.3VDC 5VDC=VCC5 Buffer V select=NetQ3_2 Buffer VCC=NetD3_3

### Notes on the sheet
- (in symbol IRF7307) 7, 8; 5, 6

### Library data of the parts
D1 = D Schottky: Schottky Diode; pin to pad: 1>2; Published: 8-Jun-2000; LatestRevisionDate: 17-Jul-2002; LatestRevisionNote: Re-released for DXP Platform.; PackageReference: SMB; Publisher: Altium Limited; PackageDescription: DO-214-AA/SMB; 2 C-Bend Leads; Body 5.3 x 3.6 mm, inc. leads (LxW); Code_JEDEC: DO-214-AA
Q1 = IRF7307: HEXFET Power MOSFET; Published: 8-Jun-2000; LatestRevisionDate: 13-Apr-2006; LatestRevisionNote: IPC-7351 Footprint Added.; DatasheetVersion: 25-Aug-1997; PackageVersion: Feb-2001; PackageReference: SO-8; Publisher: Altium Limited; PackageDescription: 8-Pin Plastic Small Outline Integrated Circuit 1.27 mm Pitch; Code_JEDEC: MS-012-AA; Code_IPC: SOIC127P600-8; ComponentLink1Description: Manufacturer Link; ComponentLink1URL: http://www.irf.com/; ComponentLink2Description: Datasheet; ComponentLink2URL: http://www.irf.com/product-info/datasheets/data/IRHG6110.pdf
R6 R48 = Res2: Resistor; Published: 8-Jun-2000; LatestRevisionDate: 17-Jul-2002; LatestRevisionNote: Re-released for DXP Platform.; PackageReference: AXIAL-0.4; Publisher: Altium Limited; PackageDescription: Axial Device, Thru-Hole; 2 Leads; 0.4 in Pin Spacing

## Nets that join several sheets
3.3VDC: ICwT_main (C17#1.2 U12#1.2 U12#1.4), TX_2 (C54.2 R36.2 R40#1.2 U11.8), SYNC_dec (C53.2 R47.2 R48.2 U17.8), RX_1 (U13.1 U13.4), TX_1 (C62.2 R54.2 R59.2 U19.8), RX_2 (U12#2.1 U12#2.4), module1/STM32 (17 pins), module1/External_iface (5 pins), module1/Power selector (D16.2), module2/STM32 (17 pins), module2/External_iface (5 pins), module2/Power selector (D2.2), module3/STM32 (17 pins), module3/External_iface (5 pins), module3/Power selector (D1.2), module4/STM32 (17 pins), module4/External_iface (5 pins), module4/Power selector (D3.2)
FT_VCC33: TX_2 (U11.1 U11.4), ICwT_ft4232 (19 pins), RX_1 (C56.2 R41.2 R49.2 U13.8), TX_1 (U19.1 U19.4), RX_2 (C50.2 R42.2 R50.2 U12#2.8)
GND: ICwT_main (5 pins), TX_2 (C54.1 U11.5), SYNC_dec (C53.1 U17.5), TX_1 (C62.1 U19.5), module1/STM32 (21 pins), module1/External_iface (8 pins), module1/Power selector (Q12.1 R56.1), module2/STM32 (21 pins), module2/External_iface (8 pins), module2/Power selector (Q2.1 R13.1), module3/STM32 (21 pins), module3/External_iface (8 pins), module3/Power selector (Q1.1 R11.1), module4/STM32 (21 pins), module4/External_iface (8 pins), module4/Power selector (Q3.1 R15.1)
UGND: ICwT_main (U7#1.2 U7#1.3), ICwT_ft4232 (33 pins), RX_1 (C56.1 U13.5), RX_2 (C50.1 U12#2.5)
VBUS: ICwT_main (U7#1.1), ICwT_ft4232 (C1#1.2 C15#1.2 J3#1.1 U15#1.3)
VCC5: ICwT_main (C3#1.2 C41#1.2 U7#1.13 U12#1.3), module1/Power selector (Q12.3 R55.2), module2/Power selector (Q2.3 R12.2), module3/Power selector (Q1.3 R10.2), module4/Power selector (Q3.3 R14.2)
/SHDN: module1/STM32 (U7#2.8), module1/External_iface (U15#2.11)
/SHDN: module2/STM32 (U8.8), module2/External_iface (U5.11)
/SHDN: module3/STM32 (U9.8), module3/External_iface (U6.11)
/SHDN: module4/STM32 (U10.8), module4/External_iface (U4.11)
clk_gen: module1/STM32 (U7#2.14 U7#2.22), module2/STM32 (U8.14 U8.22), module3/STM32 (U9.14 U9.22), module4/STM32 (U10.14 U10.22)
CS0: module1/STM32 (U7#2.59), module1/External_iface (U16.5)
CS0: module2/STM32 (U8.59), module2/External_iface (U2.5)
CS0: module3/STM32 (U9.59), module3/External_iface (U3.5)
CS0: module4/STM32 (U10.59), module4/External_iface (U1#2.5)
CS1: module1/STM32 (U7#2.58), module1/External_iface (U16.6)
CS1: module2/STM32 (U8.58), module2/External_iface (U2.6)
CS1: module3/STM32 (U9.58), module3/External_iface (U3.6)
CS1: module4/STM32 (U10.58), module4/External_iface (U1#2.6)
CS2: module1/STM32 (U7#2.57), module1/External_iface (U16.7)
CS2: module2/STM32 (U8.57), module2/External_iface (U2.7)
CS2: module3/STM32 (U9.57), module3/External_iface (U3.7)
CS2: module4/STM32 (U10.57), module4/External_iface (U1#2.7)
EXT_SYNC: SYNC_dec (R47.1 U17.7), module1/STM32 (U7#2.54), module2/STM32 (U8.54), module3/STM32 (U9.54), module4/STM32 (U10.54)
FAST: module1/STM32 (U7#2.9), module1/External_iface (U15#2.12)
FAST: module2/STM32 (U8.9), module2/External_iface (U5.12)
FAST: module3/STM32 (U9.9), module3/External_iface (U6.12)
FAST: module4/STM32 (U10.9), module4/External_iface (U4.12)
FT_RXD1: ICwT_ft4232 (U1#1.17), RX_1 (R41.1 U13.7)
FT_RXD2: ICwT_ft4232 (U1#1.27), RX_1 (R49.1 U13.6)
FT_RXD3: ICwT_ft4232 (U1#1.39), RX_2 (R50.1 U12#2.7)
FT_RXD4: ICwT_ft4232 (U1#1.52), RX_2 (R42.1 U12#2.6)
FT_TXD1: ICwT_ft4232 (U1#1.16), TX_1 (R58.1)
FT_TXD2: ICwT_ft4232 (U1#1.26), TX_1 (R53.1)
FT_TXD3: TX_2 (R37.1), ICwT_ft4232 (U1#1.38)
FT_TXD4: TX_2 (R44.1), ICwT_ft4232 (U1#1.48)
HDPLX: module1/STM32 (U7#2.11), module1/External_iface (U15#2.14)
HDPLX: module2/STM32 (U8.11), module2/External_iface (U5.14)
HDPLX: module3/STM32 (U9.11), module3/External_iface (U6.14)
HDPLX: module4/STM32 (U10.11), module4/External_iface (U4.14)
MISO: module1/STM32 (U7#2.35), module1/External_iface (U16.3)
MISO: module2/STM32 (U8.35), module2/External_iface (U2.3)
MISO: module3/STM32 (U9.35), module3/External_iface (U3.3)
MISO: module4/STM32 (U10.35), module4/External_iface (U1#2.3)
MOSI: module1/STM32 (U7#2.36), module1/External_iface (U16.4)
MOSI: module2/STM32 (U8.36), module2/External_iface (U2.4)
MOSI: module3/STM32 (U9.36), module3/External_iface (U3.4)
MOSI: module4/STM32 (U10.36), module4/External_iface (U1#2.4)
NetD1_3: module3/External_iface (U3.19), module3/Power selector (D1.3 Q1.5 Q1.6)
NetD2_3: module2/External_iface (U2.19), module2/Power selector (D2.3 Q2.5 Q2.6)
NetD3_3: module4/External_iface (U1#2.19), module4/Power selector (D3.3 Q3.5 Q3.6)
NetD16_3: module1/External_iface (U16.19), module1/Power selector (D16.3 Q12.5 Q12.6)
NetP15#1_1: ICwT_main (P15#1.1), SYNC_dec (U17.1 U17.4)
NetQ1_2: module3/STM32 (U9.23), module3/Power selector (Q1.2 R11.2)
NetQ2_2: module2/STM32 (U8.23), module2/Power selector (Q2.2 R13.2)
NetQ3_2: module4/STM32 (U10.23), module4/Power selector (Q3.2 R15.2)
NetQ12_2: module1/STM32 (U7#2.23), module1/Power selector (Q12.2 R56.2)
NetR19#1_2: ICwT_main (R19#1.2), SYNC_dec (R60.1)
NetU1#2_9: module4/STM32 (U10.39), module4/External_iface (U1#2.9)
NetU2_9: module2/STM32 (U8.39), module2/External_iface (U2.9)
NetU3_9: module3/STM32 (U9.39), module3/External_iface (U3.9)
NetU7#2_39: module1/STM32 (U7#2.39), module1/External_iface (U16.9)
RS485; /RS232: module1/STM32 (U7#2.10), module1/External_iface (P16.1 R38.2 U15#2.13)
RS485; /RS232: module2/STM32 (U8.10), module2/External_iface (P2.1 R8#2.2 U5.13)
RS485; /RS232: module3/STM32 (U9.10), module3/External_iface (P3.1 R9.2 U6.13)
RS485; /RS232: module4/STM32 (U10.10), module4/External_iface (P1.1 R7.2 U4.13)
rst_gen: module1/STM32 (U7#2.15 U7#2.16), module2/STM32 (U8.15 U8.16), module3/STM32 (U9.15 U9.16), module4/STM32 (U10.15 U10.16)
RX(TO STM): module1/STM32 (U7#2.38), module1/External_iface (U15#2.10)
RX(TO STM): module2/STM32 (U8.38), module2/External_iface (U5.10)
RX(TO STM): module3/STM32 (U9.38), module3/External_iface (U6.10)
RX(TO STM): module4/STM32 (U10.38), module4/External_iface (U4.10)
RX_U: TX_2 (R36.1 U11.7), module3/STM32 (Q5.1 U9.43)
RX_U: TX_2 (R40#1.1 U11.6), module4/STM32 (Q7.1 U10.43)
RX_U: TX_1 (R59.1 U19.7), module1/STM32 (Q4.1 U7#2.43)
RX_U: TX_1 (R54.1 U19.6), module2/STM32 (Q6.1 U8.43)
SCK: module1/STM32 (U7#2.34), module1/External_iface (U16.1)
SCK: module2/STM32 (U8.34), module2/External_iface (U2.1)
SCK: module3/STM32 (U9.34), module3/External_iface (U3.1)
SCK: module4/STM32 (U10.34), module4/External_iface (U1#2.1)
TX(FROM STM): module1/STM32 (U7#2.37), module1/External_iface (U15#2.20)
TX(FROM STM): module2/STM32 (U8.37), module2/External_iface (U5.20)
TX(FROM STM): module3/STM32 (U9.37), module3/External_iface (U6.20)
TX(FROM STM): module4/STM32 (U10.37), module4/External_iface (U4.20)
TX_U: RX_1 (R45.1), module1/STM32 (Q8.1 U7#2.42)
TX_U: RX_1 (R51.1), module2/STM32 (Q10.1 U8.42)
TX_U: RX_2 (R46.1), module3/STM32 (Q9.1 U9.42)
TX_U: RX_2 (R39.1), module4/STM32 (Q11.1 U10.42)